# Altium schematic sheet Motor_Driver_IR2184_Board_V1.0.SchDoc
size A4
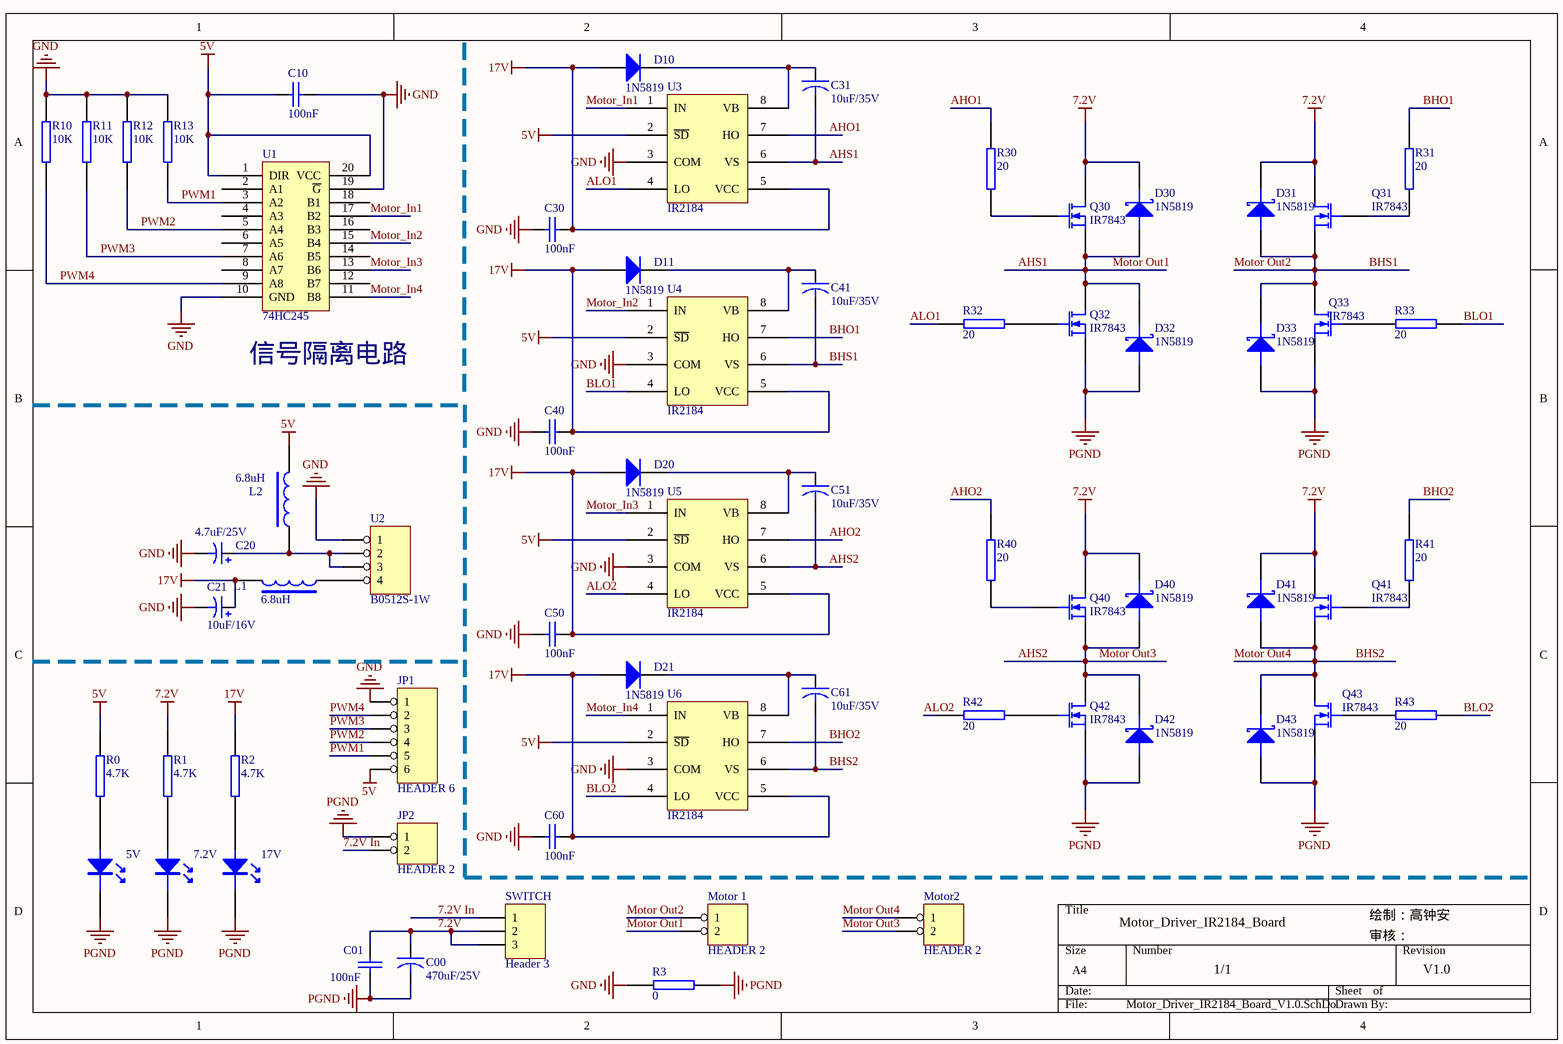
[diagram p0: Motor_Driver_IR2184_Board_V1.0.SchDoc]

## Parts
5V  (no value)  [0805_LED_S1]
7.2V  (no value)  [0805_LED_S1]
17V  (no value)  [0805_LED_S1]
C00  470uF/25V  [RB.2/.4]
C01  100nF  [0805C]
C10  100nF  [0805C]
C20  value 4.7uF/25V  [3528]
C21  value 10uF/16V  [3528]
C30  100nF  [0805C]
C31  10uF/35V  [3528]
C40  100nF  [0805C]
C41  10uF/35V  [3528]
C50  100nF  [0805C]
C51  10uF/35V  [3528]
C60  100nF  [0805C]
C61  10uF/35V  [3528]
D10  1N5819  [SOD-323]
D11  1N5819  [SOD-323]
D20  1N5819  [SOD-323]
D21  1N5819  [SOD-323]
D30  1N5819  [SOD-323]
D31  1N5819  [SOD-323]
D32  1N5819  [SOD-323]
D33  1N5819  [SOD-323]
D40  1N5819  [SOD-323]
D41  1N5819  [SOD-323]
D42  1N5819  [SOD-323]
D43  1N5819  [SOD-323]
JP1  HEADER 6  [SIP6N]
JP2  HEADER 2  [KF301-2P]
L1  6.8uH  [1206_L]
L2  6.8uH  [1206_L]
Motor2  HEADER 2  [KF301-2P]
Motor_1  HEADER 2  [KF301-2P]
Q30  IR7843  [LR7843]
Q31  IR7843  [LR7843]
Q32  IR7843  [LR7843]
Q33  IR7843  [LR7843]
Q40  IR7843  [LR7843]
Q41  IR7843  [LR7843]
Q42  IR7843  [LR7843]
Q43  IR7843  [LR7843]
R0  4.7K  [0603_R]
R1  4.7K  [0603_R]
R2  4.7K  [0603_R]
R3  0  [0805R]
R10  10K  [0603_R]
R11  10K  [0603_R]
R12  10K  [0603_R]
R13  10K  [0603_R]
R30  20  [0805]
R31  20  [0805]
R32  20  [0805]
R33  20  [0805]
R40  20  [0805]
R41  20  [0805]
R42  20  [0805]
R43  20  [0805]
SWITCH  Header 3  [KEY-3P]
U1  74HC245  [SOP20]
U2  B0512S-1W  [SIP4_B_S-1W]
U3  IR2184  [SO-8]
U4  IR2184  [SO-8]
U5  IR2184  [SO-8]
U6  IR2184  [SO-8]

## Nets
5V: C10.1 JP1.6 L2.2 R0.2 U1.1(DIR) U1.20(VCC) U3.2(~{SD}) U4.2(~{SD}) U5.2(~{SD}) U6.2(~{SD})
7.2V: C00.1 C01.2 D30.2(K) D31.2(K) D40.2(K) D41.2(K) Q30.1(D) Q31.1(D) Q40.1(D) Q41.1(D) R1.2 SWITCH.2 SWITCH.3
17V: C21.1 C30.1 C40.1 C50.1 C60.1 D10.1(A) D11.1(A) D20.1(A) D21.1(A) L1.2 R2.2 U3.5(VCC) U4.5(VCC) U5.5(VCC) U6.5(VCC)
GND: C10.2 C20.2 C21.2 C30.2 C40.2 C50.2 C60.2 JP1.1 R3.2 R10.2 R11.1 R12.2 R13.2 U1.10(GND) U1.19(~{G}) U2.1 U3.3(COM) U4.3(COM) U5.3(COM) U6.3(COM)
PGND: 5V.K 7.2V.K 17V.K C00.2 C01.1 D32.1(A) D33.1(A) D42.1(A) D43.1(A) JP2.1 Q32.3(S) Q33.3(S) Q42.3(S) Q43.3(S) R3.1
7.2V In: JP2.2 SWITCH.1
AHO1: R30.2 U3.7(HO)
AHO2: R40.2 U5.7(HO)
AHS1: C31.2 D30.1(A) D32.2(K) Motor_1.2 Q30.3(S) Q32.1(D) U3.6(VS)  [also labelled Motor Out1]
AHS2: C51.2 D40.1(A) D42.2(K) Motor2.2 Q40.3(S) Q42.1(D) U5.6(VS)  [also labelled Motor Out3]
ALO1: R32.2 U3.4(LO)
ALO2: R42.2 U5.4(LO)
BHO1: R31.2 U4.7(HO)
BHO2: R41.2 U6.7(HO)
BHS1: C41.2 D31.1(A) D33.2(K) Motor_1.1 Q31.3(S) Q33.1(D) U4.6(VS)  [also labelled Motor Out2]
BHS2: C61.2 D41.1(A) D43.2(K) Motor2.1 Q41.3(S) Q43.1(D) U6.6(VS)  [also labelled Motor Out4]
BLO1: R33.1 U4.4(LO)
BLO2: R43.1 U6.4(LO)
Motor_In1: U1.17(B2) U3.1(IN)
Motor_In2: U1.15(B4) U4.1(IN)
Motor_In3: U1.13(B6) U5.1(IN)
Motor_In4: U1.11(B8) U6.1(IN)
PWM1: JP1.5 R13.1 U1.3(A2)
PWM2: JP1.4 R12.1 U1.5(A4)
PWM3: JP1.3 R11.2 U1.7(A6)
PWM4: JP1.2 R10.1 U1.9(A8)
Net5V_A: 5V.A R0.1
Net7.2V_A: 7.2V.A R1.1
Net17V_A: 17V.A R2.1
NetC20_1: C20.1 L2.1 U2.2 U2.3
NetC31_1: C31.1 D10.2(K) U3.8(VB)
NetC41_1: C41.1 D11.2(K) U4.8(VB)
NetC51_1: C51.1 D20.2(K) U5.8(VB)
NetC61_1: C61.1 D21.2(K) U6.8(VB)
NetL1_1: L1.1 U2.4
NetQ30_2: Q30.2(G) R30.1
NetQ31_2: Q31.2(G) R31.1
NetQ32_2: Q32.2(G) R32.1
NetQ33_2: Q33.2(G) R33.2
NetQ40_2: Q40.2(G) R40.1
NetQ41_2: Q41.2(G) R41.1
NetQ42_2: Q42.2(G) R42.1
NetQ43_2: Q43.2(G) R43.2

Not connected (* = marked no-connect by the designer): U1 2(A1) 4(A3) 6(A5) 8(A7) 12(B7) 14(B5) 16(B3) 18(B1)

## Notes on the sheet
- (near U1) 信号隔离电路
- Motor_Driver_IR2184_Board
- 绘制：高钟安
- 1/1
- 审核：
- V1.0

## Library data of the parts
5V 7.2V 17V = LED
C00 C31 C41 C51 C61 = CAPACITOR
C01 C10 C30 C40 C50 C60 = CAP: Capacitor
C20 C21 = Cap Pol3: Polarized Capacitor (Surface Mount); Published: 8-Jun-2000; LatestRevisionDate: 29-May-2009; LatestRevisionNote: IPC-7351 Footprint Added.; PackageReference: C0805; Publisher: Altium Limited; PackageDescription: Chip Capacitor
D10 D11 D20 D21 = Diode: Default Diode; Published: 8-Jun-2000; LatestRevisionDate: 17-Jul-2002; LatestRevisionNote: Re-released for DXP Platform.; PackageVersion: Sep-1996; PackageReference: SMC; Publisher: Altium Limited; PackageDescription: DO-214-AB/SMC; 2 C-Bend Leads; Body 7.9 x 5.9 mm, inc. leads (LxW); Code_JEDEC: DO-214-AB
D30-D33 D40-D43 = DIODE SCHOTTKY: Schottky Diode
L1 L2 = INDUCTOR2
Q30-Q33 Q40-Q43 = MOSFET-N: N-Channel MOSFET; Published: 8-Jun-2000; LatestRevisionDate: 17-Jul-2002; LatestRevisionNote: Re-released for DXP Platform.; PackageVersion: 1995/1996; PackageReference: E3; Publisher: Altium Limited; PackageDescription: TO, Flat Index; 3 In-Line, Axial Leads; Body Dia. 4.6mm; Lead Dia. 0.5 mm (max)
R0-R3 R10-R13 R30-R33 R40-R43 = RES2
SWITCH = Header 3: Header, 3-Pin; LatestRevisionDate: 17-Jul-2002; LatestRevisionNote: Re-released for DXP Platform.; Publisher: Altium Limited
U2 = 4 HEADER: 4 Pin Header